# Altium project MyCubic.PrjPcb
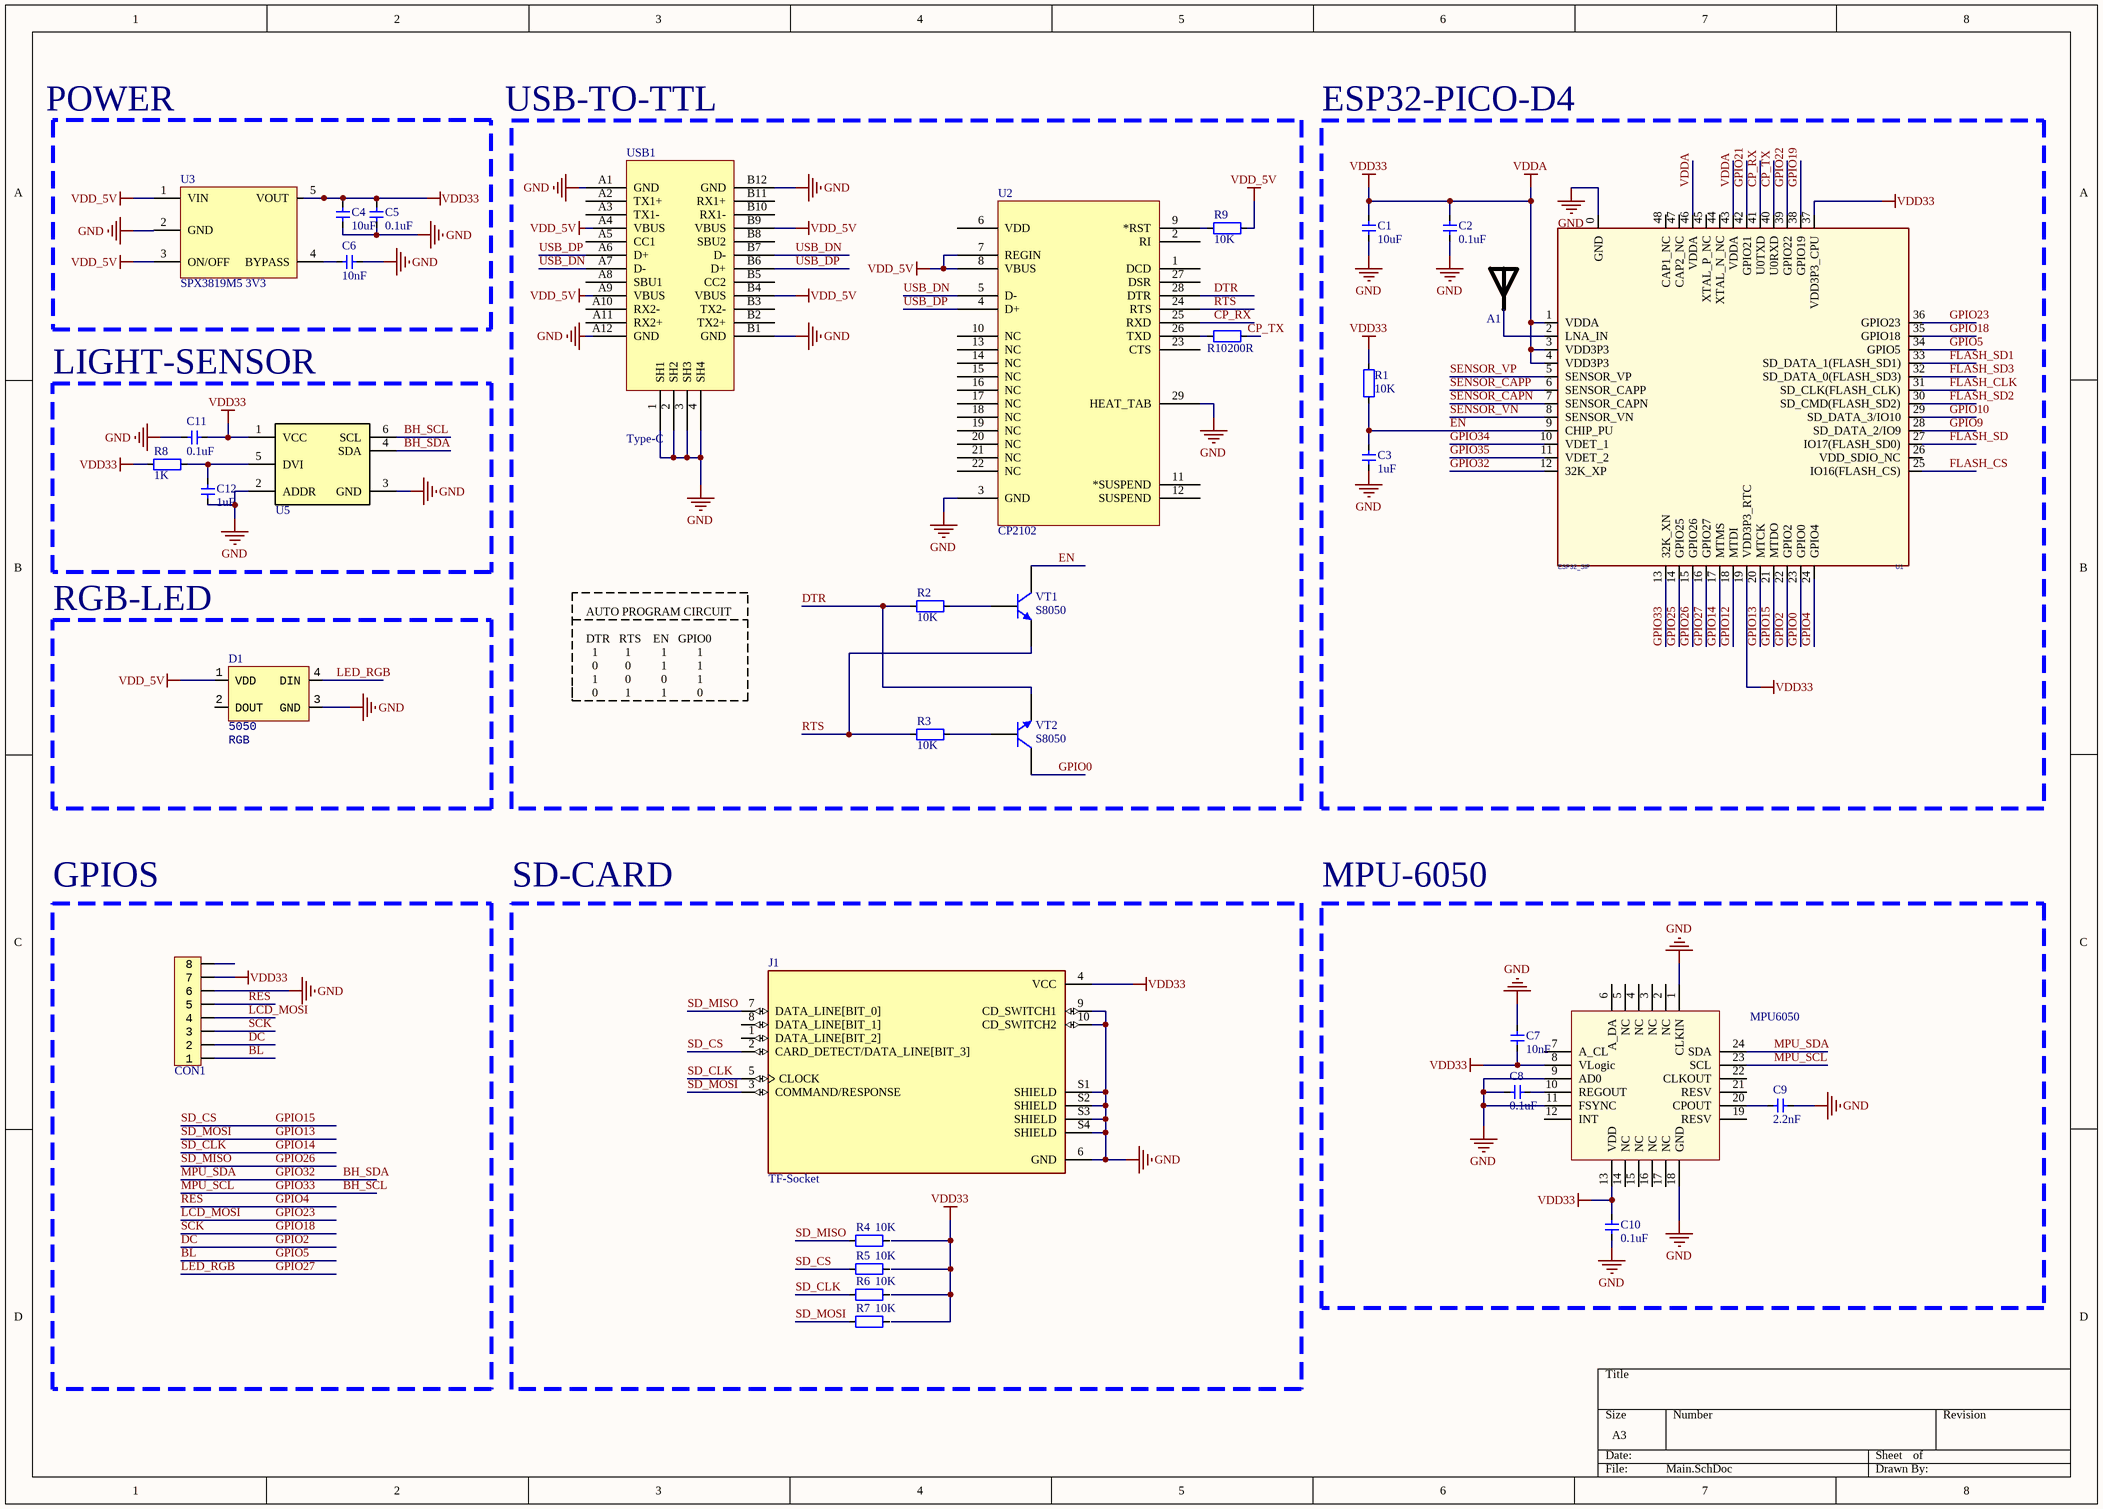
[diagram p0: Main.SchDoc]
1 sheet, 34 parts. Net scope: global (net labels, ports and power ports of the same name join across sheets).
Board file: PCB1.PcbDoc

## Sheet Main.SchDoc
size A3; SheetNumber: 1; SheetTotal: 1

### Parts
A1  RAINSUN  [ANT-Rainsun-AN5120]  (value not drawn)
C1  10uF  [CAP_0402]
C2  0.1uF  [CAP_0402]
C3  1uF  [CAP_0402]
C4  10uF  [CAP_0402]
C5  0.1uF  [CAP_0402]
C6  10nF  [CAP_0402]
C7  10nF  [CAP_0402]
C8  0.1uF  [CAP_0402]
C9  2.2nF  [CAP_0402]
C10  0.1uF  [CAP_0402]
C11  0.1uF  [CAP_0402]
C12  1uF  [CAP_0402]
CON1  FFC_0.5_8  [FFC_0.5_8]  (value not drawn)
D1  Type: 5050  [LED_5050_WS2812B]  (hidden comment: RGB)
J1  TF-Socket  [TF-Card-Amphenol with TF]
R1  10K  [RES_0402]
R2  10K  [RES_0402]
R3  10K  [RES_0402]
R4  10K  [RES_0402]
R5  10K  [RES_0402]
R6  10K  [RES_0402]
R7  10K  [RES_0402]
R8  1K  [RES_0402]
R9  10K  [RES_0402]
R10  200R  [RES_0402]
U1  ESP32_SIP  [QFN-48_7X7]
U2  CP2102  [QFN-28]
U3  SPX3819M5 3V3  [SOT23-5]
U4  MPU6050  [QFN-24]
U5  BH1750FVI-TR  [BH1750FVI]  (value not drawn)
USB1  Type-C  [Type-C-TOP]
VT1  S8050  [SMT_TRIODE_NPN]
VT2  S8050  [SMT_TRIODE_NPN]

### Blocks framed on the sheet
ESP32-PICO-D4: A1 C1-C3 R1 U1
LIGHT-SENSOR: C11 C12 R8 U5
RGB-LED: D1
GPIOS: CON1
SD-CARD: J1 R4-R7
MPU-6050: C7-C10 U4

### Nets
GND: C1.1 C2.1 C3.1 C4.1 C5.1 C6.1 C7.1 C8.2 C9.1 C10.1 C11.2 C12.2 CON1.6 D1.3(GND) J1.6(GND) J1.9(CD_SWITCH1) J1.10(CD_SWITCH2) J1.S1(SHIELD) J1.S2(SHIELD) J1.S3(SHIELD) J1.S4(SHIELD) U1.0(GND) U2.3(GND) U2.29(HEAT_TAB) U3.2(GND) U4.1(CLKIN) U4.9(AD0) U4.11(FSYNC) U4.18(GND) U5.2(ADDR) U5.3(GND) USB1.1(SH1) USB1.2(SH2) USB1.3(SH3) USB1.4(SH4) USB1.A1(GND) USB1.A12(GND) USB1.B1(GND) USB1.B12(GND)
VDD_5V: D1.1(VDD) R9.1 U2.7(REGIN) U2.8(VBUS) U3.1(VIN) U3.3(ON/OFF) USB1.A4(VBUS) USB1.A9(VBUS) USB1.B4(VBUS) USB1.B9(VBUS)
VDDA: C1.2 C2.2 C4.2 C5.2 C7.2 C10.2 C11.1 CON1.7 J1.4(VCC) R1.2 R8.2 U1.1(VDDA) U1.3(VDD3P3) U1.4(VDD3P3) U1.19(VDD3P3_RTC) U1.37(VDD3P3_CPU) U1.43(VDDA) U1.46(VDDA) U3.5(VOUT) U4.8(VLogic) U4.13(VDD) U5.1(VCC)  [also labelled VDD33]
BH_SCL: U1.13(32K_XN) U4.23(SCL) U5.6(SCL)  [also labelled GPIO33, MPU_SCL]
BH_SDA: U1.12(32K_XP) U4.24(SDA) U5.4(SDA)  [also labelled GPIO32, MPU_SDA]
BL: CON1.1 U1.34(GPIO5)  [also labelled GPIO5]
CP_RX: U1.41(U0TXD) U2.25(RXD)
CP_TX: R10.1 U1.40(U0RXD)
DC: CON1.2 U1.22(GPIO2)  [also labelled GPIO2]
DTR: R2.2 U2.28(DTR) VT2.2(E)
EN: C3.2 R1.1 U1.9(CHIP_PU) VT1.3(C)
FLASH_CLK: U1.31(SD_CLK(FLASH_CLK))
FLASH_CS: U1.25(IO16(FLASH_CS))
FLASH_SD: U1.27(IO17(FLASH_SD0))
FLASH_SD1: U1.33(SD_DATA_1(FLASH_SD1))
FLASH_SD2: U1.30(SD_CMD(FLASH_SD2))
FLASH_SD3: U1.32(SD_DATA_0(FLASH_SD3))
GPIO0: U1.23(GPIO0) VT2.3(C)
GPIO4: CON1.5 U1.24(GPIO4)  [also labelled RES]
GPIO9: U1.28(SD_DATA_2/IO9)
GPIO10: U1.29(SD_DATA_3/IO10)
GPIO12: U1.18(MTDI)
GPIO13: J1.3(COMMAND/RESPONSE) R7.2 U1.20(MTCK)  [also labelled SD_MOSI]
GPIO14: J1.5(CLOCK) R6.2 U1.17(MTMS)  [also labelled SD_CLK]
GPIO15: J1.2(CARD_DETECT/DATA_LINE[BIT_3]) R5.2 U1.21(MTDO)  [also labelled SD_CS]
GPIO18: CON1.3 U1.35(GPIO18)  [also labelled SCK]
GPIO19: U1.38(GPIO19)
GPIO21: U1.42(GPIO21)
GPIO22: U1.39(GPIO22)
GPIO23: CON1.4 U1.36(GPIO23)  [also labelled LCD_MOSI]
GPIO25: U1.14(GPIO25)
GPIO26: J1.7(DATA_LINE[BIT_0]) R4.2 U1.15(GPIO26)  [also labelled SD_MISO]
GPIO27: D1.4(DIN) U1.16(GPIO27)  [also labelled LED_RGB]
GPIO34: U1.10(VDET_1)
GPIO35: U1.11(VDET_2)
RTS: R3.2 U2.24(RTS) VT1.2(E)
SENSOR_CAPN: U1.7(SENSOR_CAPN)
SENSOR_CAPP: U1.6(SENSOR_CAPP)
SENSOR_VN: U1.8(SENSOR_VN)
SENSOR_VP: U1.5(SENSOR_VP)
USB_DN: U2.5(D-) USB1.A7(D-) USB1.B7(D-)
USB_DP: U2.4(D+) USB1.A6(D+) USB1.B6(D+)
NetA1_1: A1.1 U1.2(LNA_IN)
NetC6_2: C6.2 U3.4(BYPASS)
NetC8_1: C8.1 U4.10(REGOUT)
NetC9_2: C9.2 U4.20(CPOUT)
NetC12_1: C12.1 R8.1 U5.5(DVI)
NetR2_1: R2.1 VT1.1(B)
NetR3_1: R3.1 VT2.1(B)
NetR9_2: R9.2 U2.9(*RST)
NetR10_2: R10.2 U2.26(TXD)

Not connected (* = marked no-connect by the designer): CON1 8; D1 2(DOUT); J1 1(DATA_LINE[BIT_2]) 8(DATA_LINE[BIT_1]); R4 1; R5 1; R6 1; R7 1; U1 26(VDD_SDIO_NC) 44(XTAL_N_NC) 45(XTAL_P_NC) 47(CAP2_NC) 48(CAP1_NC); U2 1(DCD) 2(RI) 6(VDD) 10(NC) 11(*SUSPEND) 12(SUSPEND) 13(NC) 14(NC) 15(NC) 16(NC) 17(NC) 18(NC) 19(NC) 20(NC) 21(NC) 22(NC) 23(CTS) 27(DSR); U4 2(NC) 3(NC) 4(NC) 5(NC) 6(A_DA) 7(A_CL) 12(INT) 14(NC) 15(NC) 16(NC) 17(NC) 19(RESV) 21(RESV) 22(CLKOUT); USB1 A2(TX1+) A3(TX1-) A5(CC1) A8(SBU1) A10(RX2-) A11(RX2+) B2(TX2+) B3(TX2-) B5(CC2) B8(SBU2) B10(RX1-) B11(RX1+)

### Notes on the sheet
- POWER
- USB-TO-TTL
- AUTO PROGRAM CIRCUIT
  DTR   RTS    EN   GPIO0
  1         1          1          1
  0         0          1          1
  1         0          0          1
  0         1          1          0

### Library data of the parts
A1 = ANT-Rainsun-AP5120
C1 C3 C4 = 电容-0402_3: Capacitor; Value: 10u
C2 C5-C12 = 电容-0402: Capacitor; Value: 0.1u
CON1 = FFC_0.5_8: FFC; System: Connector
D1 = LED_5050_WS2812B: LED; Value: RGB
J1 = TF-Socket: 10 _8 + 2_ Position Card Connector Secure Digital - microSDâ„¢ Surface Mount, Right Angle Gold; MP: 1140084168; MF: Amphenol Commercial Products; SnapEDA_Link: https://www.snapeda.com/parts/1140084168/Amphenol/view-part/4544529/?ref=snap; Availability: Unavailable; Price: None; Value: *; Package: None
R1-R10 = 电阻-0402_1: Resistor; Value: 22R
U1 = ESP32-PICO
U2 = CP2102: USB转TTL; PART DESC: SINGLE-CHIP USB TO UART BRIDGE, QFN28, RoHS.; MFG #1: SILICON LABS; PART NUMBER: CP2102; Value: Value; RefDes: RefDes; Type: DEV
U3 = LP2992: LDO
U4 = MPU6050: 六轴传感器
USB1 = USB-Type-C-TOP
VT1 VT2 = SMT_TRIODE_NPN: Surface mount NPN transistor, package SOT-23